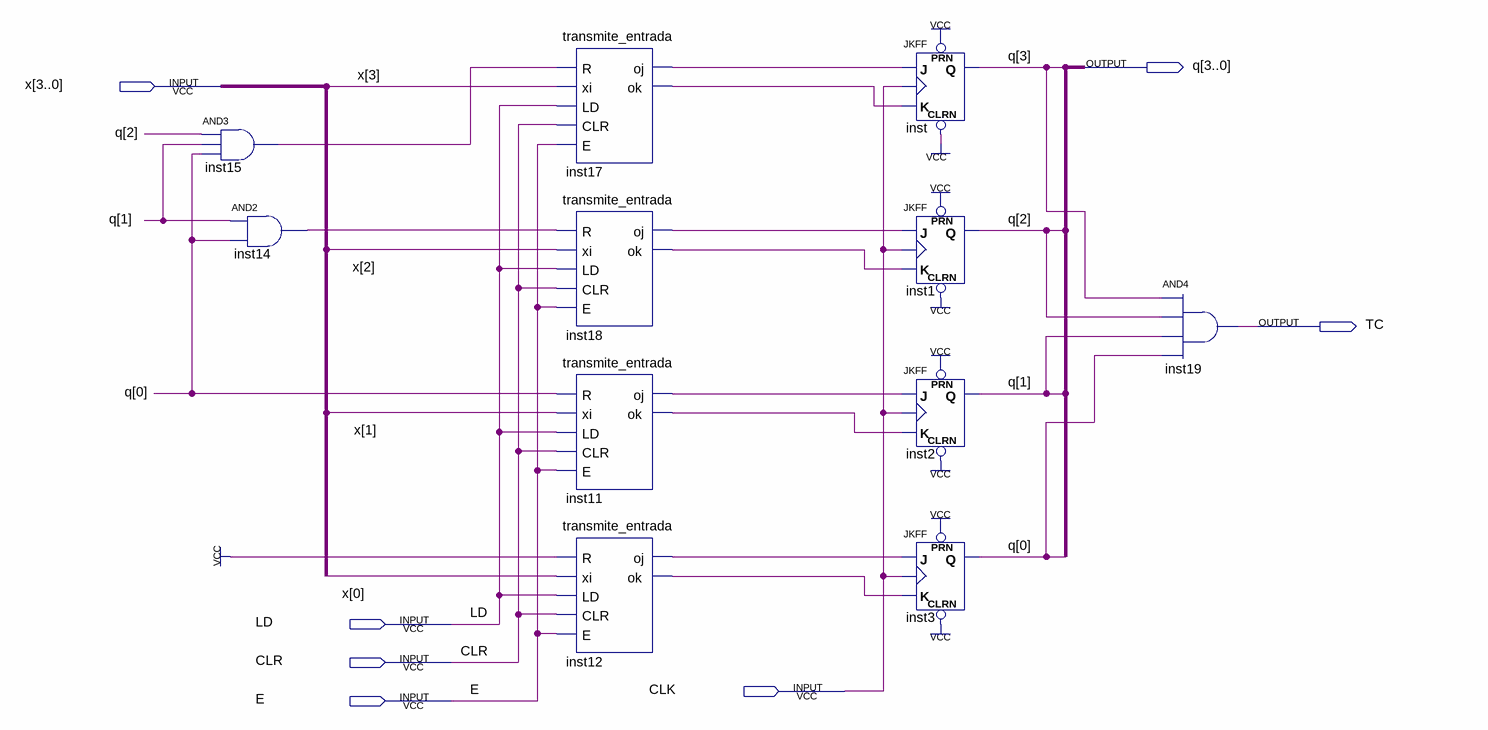
[diagram p0: schematic sheet]
// Quartus schematic contador_mod16.bdf as structural Verilog: 11 symbols, 7 pins
module contador_mod16 (
  input  [3:0] x,
  input  LD,
  input  CLR,
  input  CLK,
  input  E,
  output [3:0] q,
  output TC
);

  wire inst11_oj, inst11_ok, inst12_oj, inst12_ok, inst14_out, inst15_out, inst17_oj, inst17_ok, inst18_oj,
       inst18_ok;

  and inst15 (inst15_out, q[2], q[1], q[0]);
  and inst14 (inst14_out, q[1], q[0]);
  transmite_entrada inst17 (.R(inst15_out), .xi(x[3]), .LD(LD), .CLR(CLR), .E(E), .oj(inst17_oj), .ok(inst17_ok));
  transmite_entrada inst18 (.R(inst14_out), .xi(x[2]), .LD(LD), .CLR(CLR), .E(E), .oj(inst18_oj), .ok(inst18_ok));
  transmite_entrada inst11 (.R(q[0]), .xi(x[1]), .LD(LD), .CLR(CLR), .E(E), .oj(inst11_oj), .ok(inst11_ok));
  transmite_entrada inst12 (.R(1'b1), .xi(x[0]), .LD(LD), .CLR(CLR), .E(E), .oj(inst12_oj), .ok(inst12_ok));
  JKFF inst (.PRN(1'b1), .CLRN(1'b1), .K(inst17_ok), .J(inst17_oj), .CLK(CLK), .Q(q[3]));
  JKFF inst1 (.PRN(1'b1), .CLRN(1'b1), .K(inst18_ok), .J(inst18_oj), .CLK(CLK), .Q(q[2]));
  JKFF inst2 (.PRN(1'b1), .CLRN(1'b1), .K(inst11_ok), .J(inst11_oj), .CLK(CLK), .Q(q[1]));
  JKFF inst3 (.PRN(1'b1), .CLRN(1'b1), .K(inst12_ok), .J(inst12_oj), .CLK(CLK), .Q(q[0]));
  and inst19 (TC, q[3], q[2], q[1], q[0]);
endmodule
